# EAGLE design 1601_board_firmata (EAGLE 9.6.2)
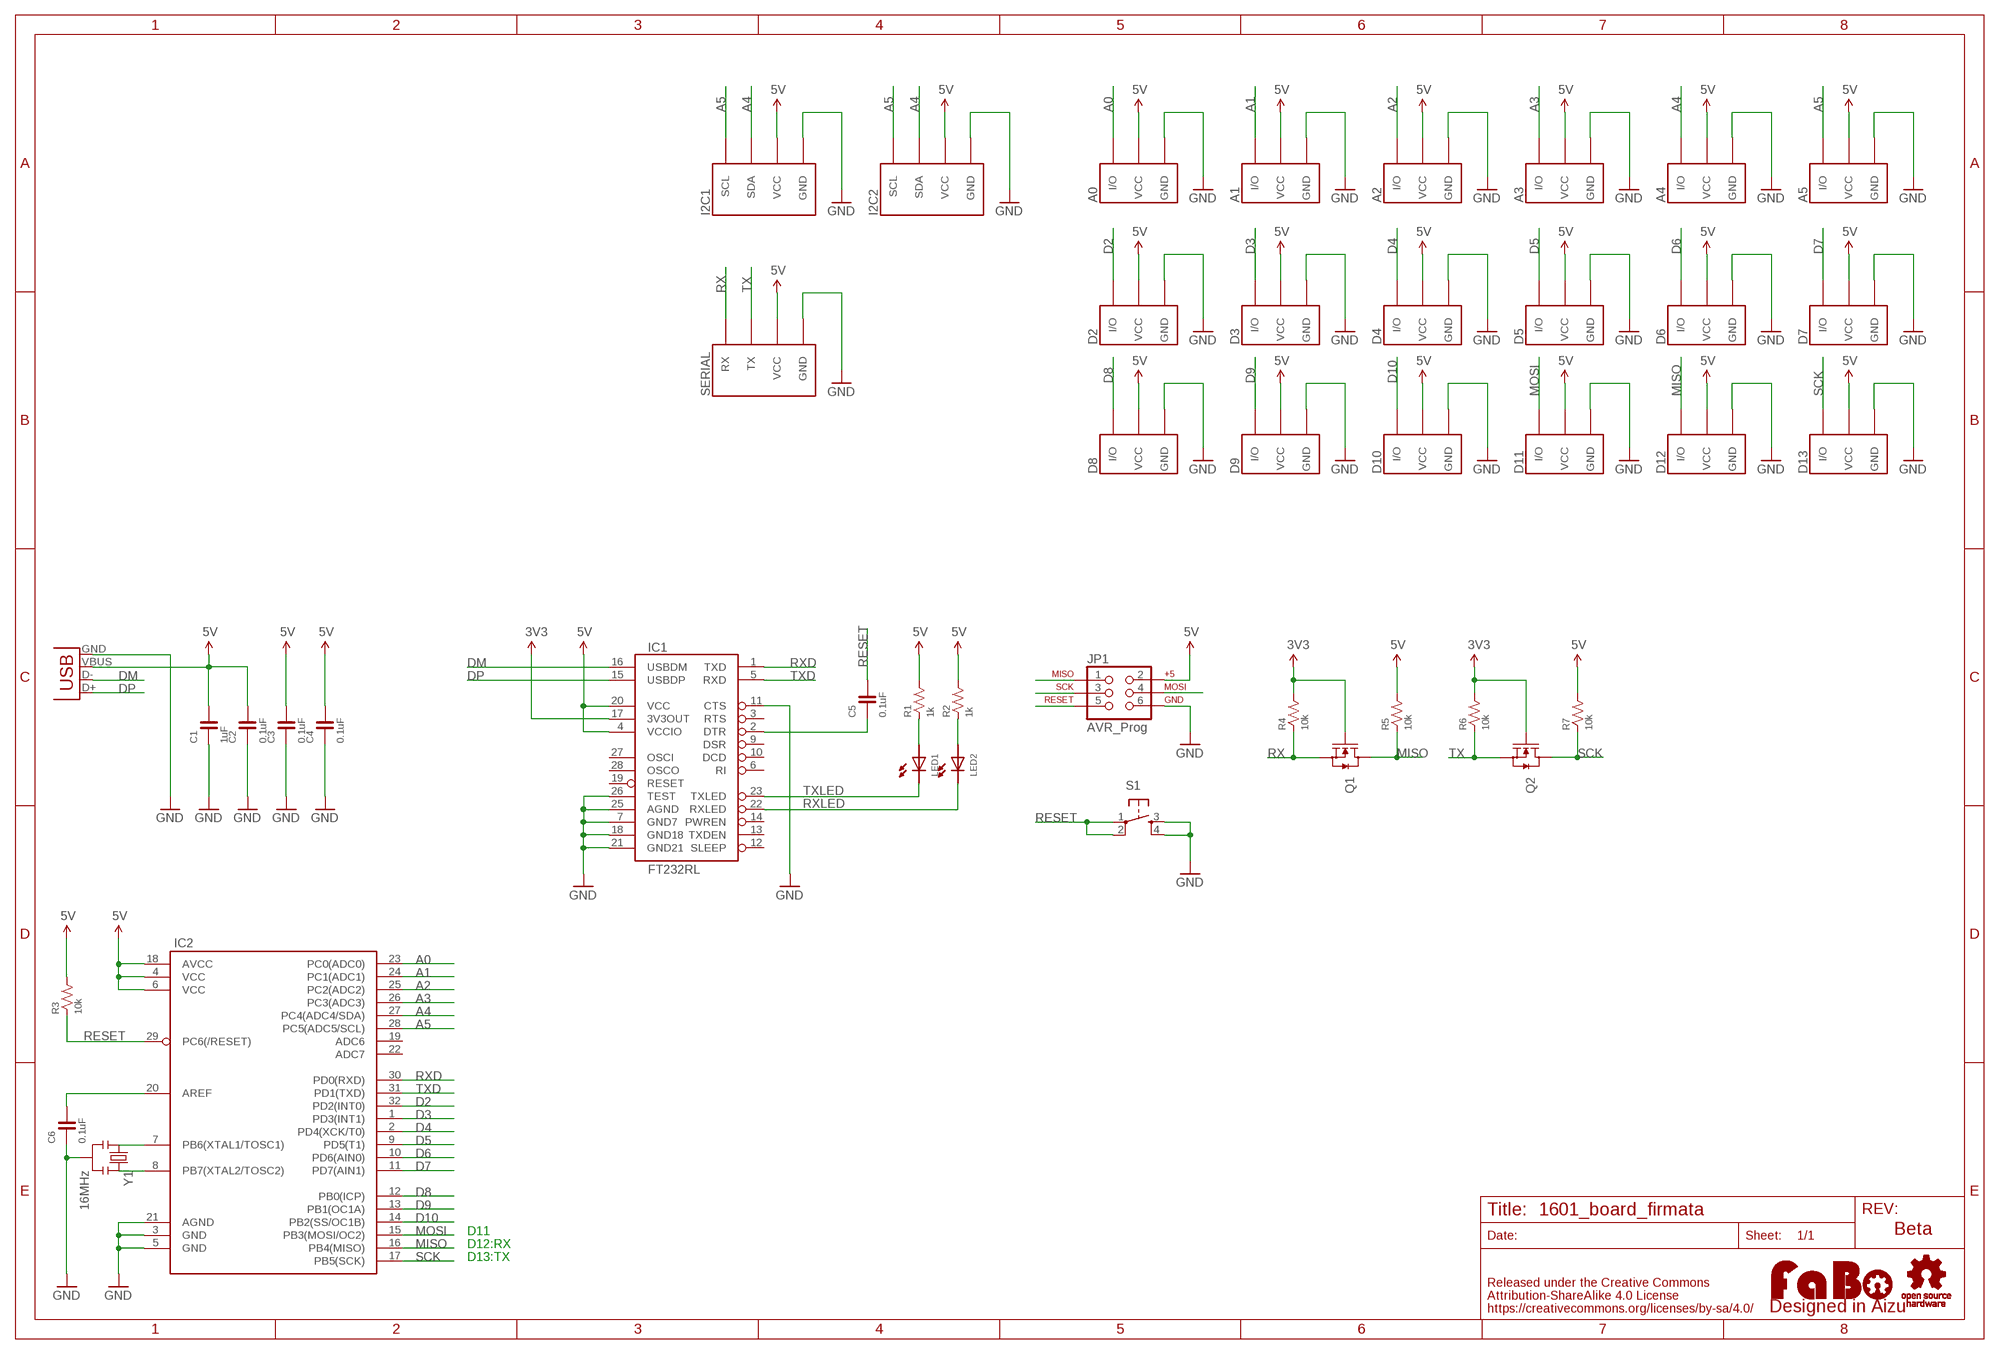
[diagram p0: schematic, sheet 1]

## Parts
A0  FABO_BRICK_3PIN-S03B-PASK-2  [FABO_BRICK_3PIN_S03B-PASK-2]
A1  FABO_BRICK_3PIN-S03B-PASK-2  [FABO_BRICK_3PIN_S03B-PASK-2]
A2  FABO_BRICK_3PIN-S03B-PASK-2  [FABO_BRICK_3PIN_S03B-PASK-2]
A3  FABO_BRICK_3PIN-S03B-PASK-2  [FABO_BRICK_3PIN_S03B-PASK-2]
A4  FABO_BRICK_3PIN-S03B-PASK-2  [FABO_BRICK_3PIN_S03B-PASK-2]
A5  FABO_BRICK_3PIN-S03B-PASK-2  [FABO_BRICK_3PIN_S03B-PASK-2]
C1  1uF  CAPACITOR-0603  [0603]
C2  0.1uF  CAPACITOR-0603  [0603]
C3  0.1uF  CAPACITOR-0603  [0603]
C4  0.1uF  CAPACITOR-0603  [0603]
C5  0.1uF  CAPACITOR-0603  [0603]
C6  0.1uF  CAPACITOR-0603  [0603]
D2  FABO_BRICK_3PIN-B03B-PASK-1  [FABO_BRICK_3PIN_B03B-PASK-1]
D3  FABO_BRICK_3PIN-B03B-PASK-1  [FABO_BRICK_3PIN_B03B-PASK-1]
D4  FABO_BRICK_3PIN-B03B-PASK-1  [FABO_BRICK_3PIN_B03B-PASK-1]
D5  FABO_BRICK_3PIN-B03B-PASK-1  [FABO_BRICK_3PIN_B03B-PASK-1]
D6  FABO_BRICK_3PIN-B03B-PASK-1  [FABO_BRICK_3PIN_B03B-PASK-1]
D7  FABO_BRICK_3PIN-B03B-PASK-1  [FABO_BRICK_3PIN_B03B-PASK-1]
D8  FABO_BRICK_3PIN-B03B-PASK-1  [FABO_BRICK_3PIN_B03B-PASK-1]
D9  FABO_BRICK_3PIN-B03B-PASK-1  [FABO_BRICK_3PIN_B03B-PASK-1]
D10  FABO_BRICK_3PIN-B03B-PASK-1  [FABO_BRICK_3PIN_B03B-PASK-1]
D11  FABO_BRICK_3PIN-B03B-PASK-1  [FABO_BRICK_3PIN_B03B-PASK-1]
D12  FABO_BRICK_3PIN-B03B-PASK-1  [FABO_BRICK_3PIN_B03B-PASK-1]
D13  FABO_BRICK_3PIN-B03B-PASK-1  [FABO_BRICK_3PIN_B03B-PASK-1]
I2C1  FABO_BRICK_I2C-S04B-PASK-2  [FABO_BRICK_I2C_S04B-PASK-2]
I2C2  FABO_BRICK_I2C-S04B-PASK-2  [FABO_BRICK_I2C_S04B-PASK-2]
IC1  FT232RL  [SSOP28]
IC2  ATMEGA328P-AU-TQFP32  [TQFP-32-08]
JP1  AVR_Prog  AVR_ISP-TC  [TC2030-MCP]
LED1  LED-0603  [0603]
LED2  LED-0603  [0603]
Q1  MOSFET-N-BSS138  [SOT23-3]
Q2  MOSFET-N-BSS138  [SOT23-3]
R1  1k  RESISTOR-0603  [0603]
R2  1k  RESISTOR-0603  [0603]
R3  10k  RESISTOR-0603  [0603]
R4  10k  RESISTOR-0603  [0603]
R5  10k  RESISTOR-0603  [0603]
R6  10k  RESISTOR-0603  [0603]
R7  10k  RESISTOR-0603  [0603]
S1  TACT-SWITCH-SMD_KMR2  [KMR2]
SERIAL  FABO_BRICK_SERIAL-S04B-PASK-2  [FABO_BRICK_SERIAL_S04B-PASK-2]
U$2  LOGO_OSHW-T_M_BOTTOM  [LOGO_OSHW_T_MS_BOTTOM]
U$3  LOGO_FABO-M  [LOGO_FABO_MS]
USB1  USB-B-MICRO_SMD  [USB_B_MICRO]
Y1  16MHz  RESONATOR  [RESONATOR_SMD]

## Nets
3V3: IC1.17(3V3OUT) Q1.1(G) Q2.1(G) R4.2 R6.2
5V: A0.VCC A1.VCC A2.VCC A3.VCC A4.VCC A5.VCC C1.2 C2.2 C3.2 C4.2 D2.VCC D3.VCC D4.VCC D5.VCC D6.VCC D7.VCC D8.VCC D9.VCC D10.VCC D11.VCC D12.VCC D13.VCC I2C1.VCC I2C2.VCC IC1.4(VCCIO) IC1.20(VCC) IC2.4(VCC) IC2.6(VCC) IC2.18(AVCC) JP1.2 R1.2 R2.2 R3.2 R5.2 R7.2 SERIAL.VCC USB1.VBUS
A0: A0.I/O IC2.23(PC0(ADC0))
A1: A1.I/O IC2.24(PC1(ADC1))
A2: A2.I/O IC2.25(PC2(ADC2))
A3: A3.I/O IC2.26(PC3(ADC3))
A4: A4.I/O I2C1.SDA I2C2.SDA IC2.27(PC4(ADC4/SDA))
A5: A5.I/O I2C1.SCL I2C2.SCL IC2.28(PC5(ADC5/SCL))
D2: D2.I/O IC2.32(PD2(INT0))
D3: D3.I/O IC2.1(PD3(INT1))
D4: D4.I/O IC2.2(PD4(XCK/T0))
D5: D5.I/O IC2.9(PD5(T1))
D6: D6.I/O IC2.10(PD6(AIN0))
D7: D7.I/O IC2.11(PD7(AIN1))
D8: D8.I/O IC2.12(PB0(ICP))
D9: D9.I/O IC2.13(PB1(OC1A))
D10: D10.I/O IC2.14(PB2(SS/OC1B))
DM: IC1.16(USBDM) USB1.D-
DP: IC1.15(USBDP) USB1.D+
DTR: C5.1 IC1.2(DTR)
GND: A0.GND A1.GND A2.GND A3.GND A4.GND A5.GND C1.1 C2.1 C3.1 C4.1 C6.1 D2.GND D3.GND D4.GND D5.GND D6.GND D7.GND D8.GND D9.GND D10.GND D11.GND D12.GND D13.GND I2C1.GND I2C2.GND IC1.7(GND7) IC1.11(CTS) IC1.18(GND18) IC1.21(GND21) IC1.25(AGND) IC1.26(TEST) IC2.3(GND) IC2.5(GND) IC2.21(AGND) JP1.6 S1.3 S1.4 SERIAL.GND USB1.GND Y1.2
MISO: D12.I/O IC2.16(PB4(MISO)) JP1.1 Q1.3(D) R5.1
MOSI: D11.I/O IC2.15(PB3(MOSI/OC2)) JP1.4
N$1: LED1.ANODE R1.1
N$2: C6.2 IC2.20(AREF)
N$3: IC2.8(PB7(XTAL2/TOSC2)) Y1.3
N$4: IC2.7(PB6(XTAL1/TOSC1)) Y1.1
N$30: LED2.ANODE R2.1
RESET: C5.2 IC2.29(PC6(/RESET)) JP1.5 R3.1 S1.1 S1.2
RX: Q1.2(S) R4.1 SERIAL.RX
RXD: IC1.1(TXD) IC2.30(PD0(RXD))
RXLED: IC1.22(RXLED) LED2.CATHODE
SCK: D13.I/O IC2.17(PB5(SCK)) JP1.3 Q2.3(D) R7.1
TX: Q2.2(S) R6.1 SERIAL.TX
TXD: IC1.5(RXD) IC2.31(PD1(TXD))
TXLED: IC1.23(TXLED) LED1.CATHODE
Unconnected: IC1.3(RTS) IC1.6(RI) IC1.9(DSR) IC1.10(DCD) IC1.12(SLEEP) IC1.13(TXDEN) IC1.14(PWREN) IC1.19(RESET) IC1.27(OSCI) IC1.28(OSCO) IC2.19(ADC6) IC2.22(ADC7)

## Notes on the sheet
- D11 | Beta
- D12:RX
- D13:TX

## Library data of the parts
A0 A1-A5 D2-D13 = FaBo-Template:FABO_BRICK_3PIN: FaBo Brick 3pin
C1-C6 = FaBo-Capacitor:CAPACITOR: CAPACITOR
I2C1 I2C2 = FaBo-Template:FABO_BRICK_I2C: FaBo Brick I2C
IC1 = Gclue:FT232RL: FT232RL FTDI FT232RL USB to serial UART interface SSOP28
IC2 = FaBo-etc:ATMEGA328P-AU: ATmega328p-AU
JP1 = Gclue:AVR_ISP
LED1 LED2 = FaBo-LED:LED
Q1 Q2 = FaBo-etc:MOSFET-N
R1-R7 = FaBo-Resistors:RESISTOR: RESISTOR
S1 = FaBo-Switch:TACT-SWITCH
SERIAL = FaBo-Template:FABO_BRICK_SERIAL: FaBo Brick Serial
U$2 = FaBo-etc:LOGO_OSHW
U$3 = FaBo-Logo:LOGO_FABO
USB1 = Gclue:USB: USB Female
Y1 = Gclue:RESONATOR: RESONATOR CSTCE16M0V53

## Board
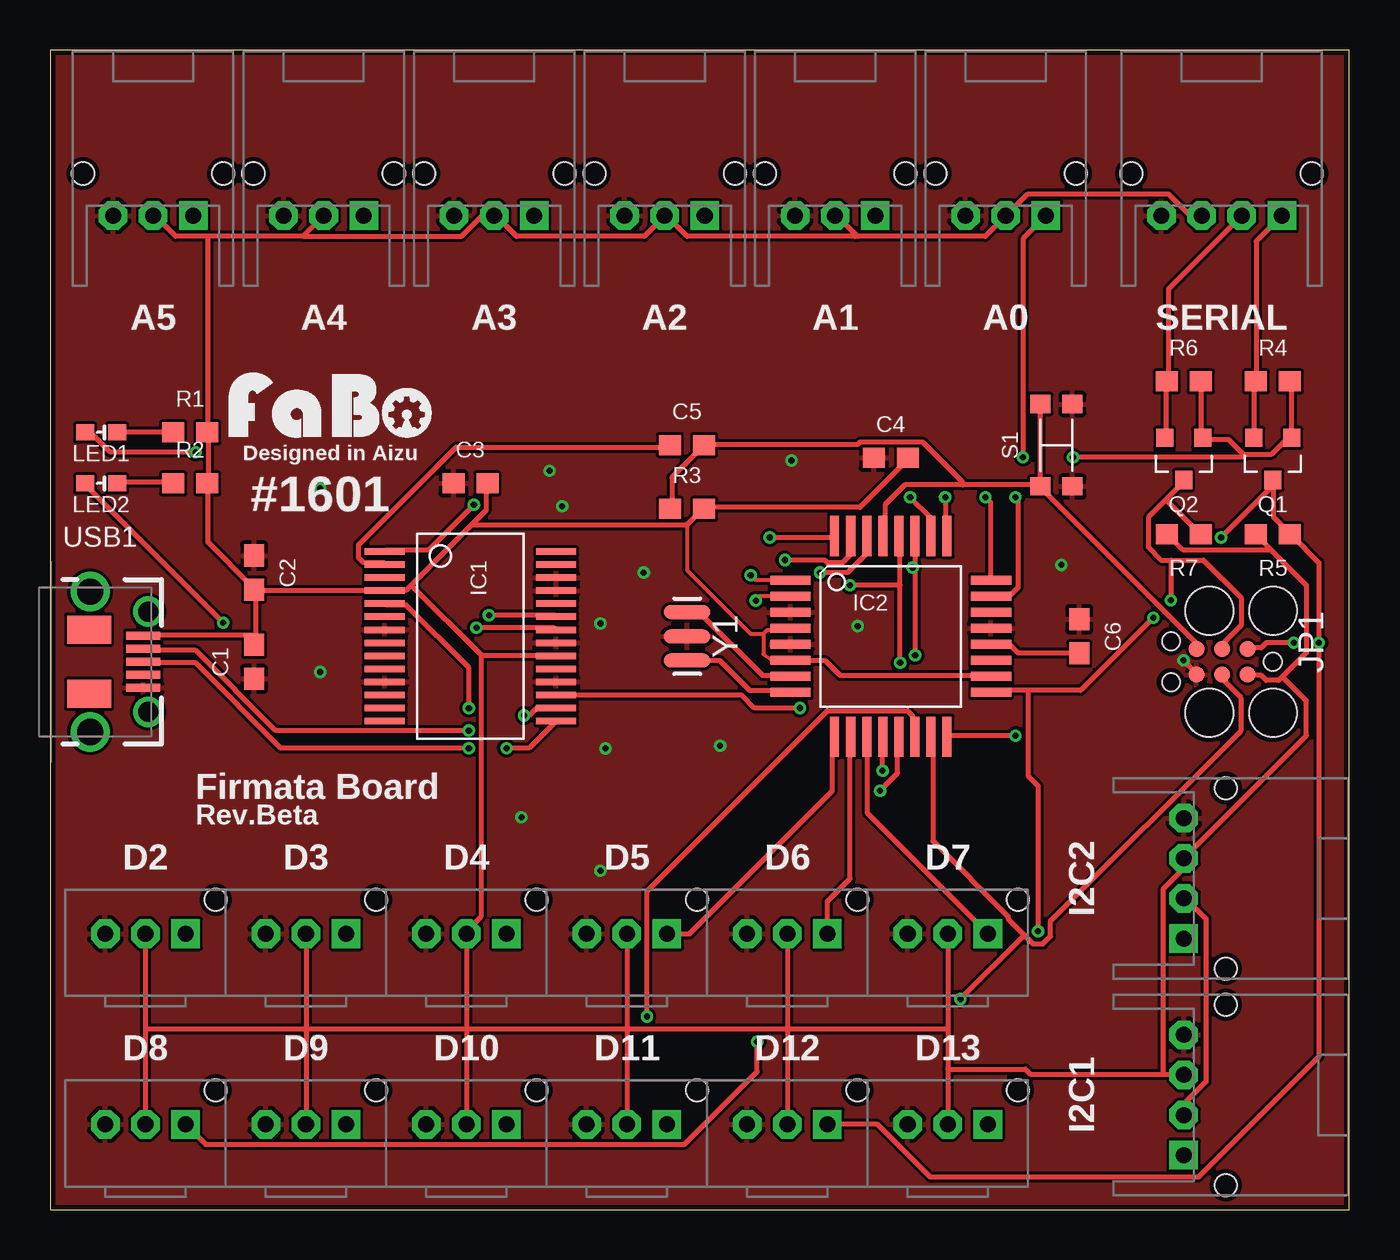
[diagram p1: board, top side]
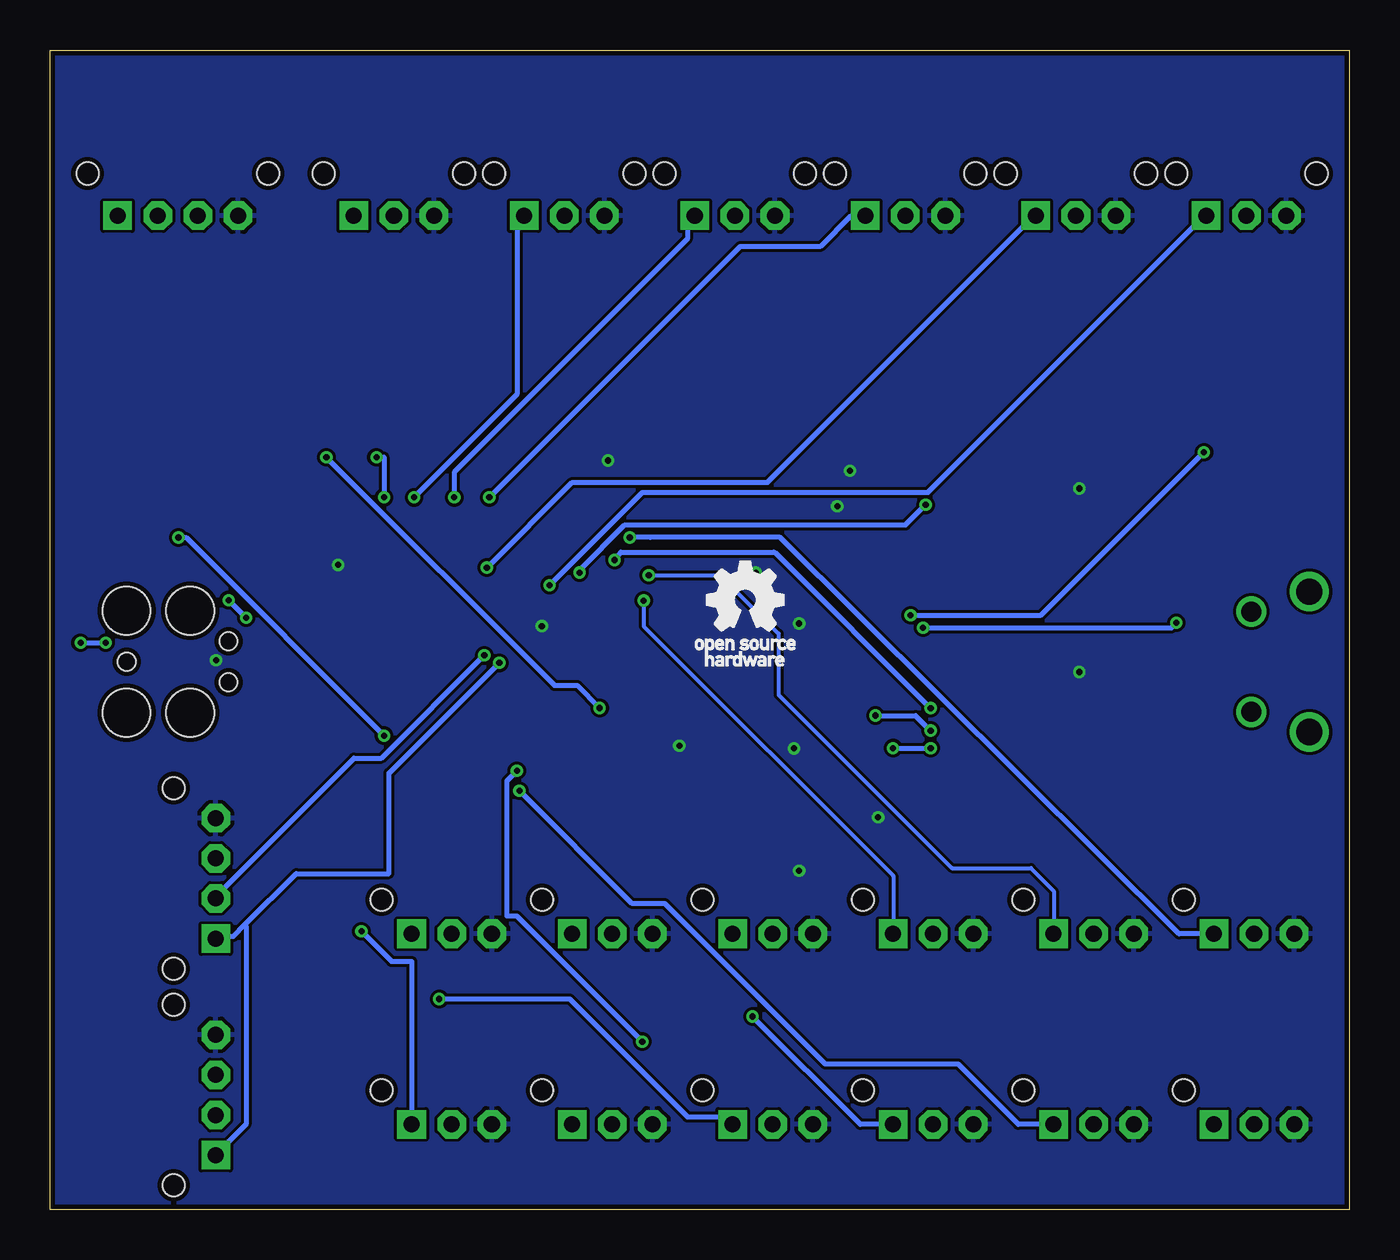
[diagram p2: board, bottom side, seen from below]

Size 64.77 x 57.78 mm. Coordinates in mm from the lower left corner, seen from the top.
Outline: 0,0 64.77,0 64.77,57.78 0,57.78 0,0
Copper layers (1*16): Top 0.035mm / dielectric 1.6mm / Bottom 0.035mm
Design rules "PCBway": minimum track width 6mil, minimum drill 12mil, track to track 6mil, track to pad 6mil, pad to pad 6mil, via to via 6mil, smd to smd 6mil, copper to edge 10mil, drill to drill 10mil, minimum pad ring 10mil, minimum via ring 6mil, stop-mask expansion 2mil, vias tented up to drill 100mil, thermal gap 8mil

### Footprints (pad centres in the part's own frame; a part is rotated, then mirrored left to right if it is on the bottom)
FABO_BRICK_3PIN_S03B-PASK-2 = drill 0.8 pad 1.422 octagon: GND -2,0; VCC 0,0 | drill 0.8 pad 1.422 square: I/O 2,0 | hole 1.1: 3.5,2.1; -3.5,2.1
0603 = smd 1.1 x 1: 1 -0.85,0; 2 0.85,0
FABO_BRICK_3PIN_B03B-PASK-1 = drill 0.8 pad 1.422 octagon: GND -2,0; VCC 0,0 | drill 0.8 pad 1.422 square: I/O 2,0 | hole 1.1: 3.5,1.7
FABO_BRICK_I2C_S04B-PASK-2 = drill 0.8 pad 1.422 octagon: GND -3,0; SDA 1,0; VCC -1,0 | drill 0.8 pad 1.422 square: SCL 3,0 | hole 1.1: 4.5,2.1; -4.5,2.1
SSOP28 = smd 0.325 x 2: 1 -4.225,-4.275; 2 -3.575,-4.275; 3 -2.925,-4.275; 4 -2.275,-4.275; 5 -1.625,-4.275; 6 -0.975,-4.275; 7 -0.325,-4.275; 8 0.325,-4.275; 9 0.975,-4.275; 10 1.625,-4.275; 11 2.275,-4.275; 12 2.925,-4.275; 13 3.575,-4.275; 14 4.225,-4.275; 15 4.225,4.275; 16 3.575,4.275; 17 2.925,4.275; 18 2.275,4.275; 19 1.625,4.275; 20 0.975,4.275; 21 0.325,4.275; 22 -0.325,4.275; 23 -0.975,4.275; 24 -1.625,4.275; 25 -2.275,4.275; 26 -2.925,4.275; 27 -3.575,4.275; 28 -4.225,4.275
TQFP-32-08 = smd 2 x 0.45: 1 -5,2.8; 2 -5,2; 3 -5,1.2; 4 -5,0.4; 5 -5,-0.4; 6 -5,-1.2; 7 -5,-2; 8 -5,-2.8; 17 5,-2.8; 18 5,-2; 19 5,-1.2; 20 5,-0.4; 21 5,0.4; 22 5,1.2; 23 5,2; 24 5,2.8 | smd 0.45 x 2: 9 -2.8,-5; 10 -2,-5; 11 -1.2,-5; 12 -0.4,-5; 13 0.4,-5; 14 1.2,-5; 15 2,-5; 16 2.8,-5; 25 2.8,5; 26 2,5; 27 1.2,5; 28 0.4,5; 29 -0.4,5; 30 -1.2,5; 31 -2,5; 32 -2.8,5
TC2030-MCP = smd 0.787 x 0.787: 1 -1.27,-0.635; 2 -1.27,0.635; 3 0,-0.635; 4 0,0.635; 5 1.27,-0.635; 6 1.27,0.635 | hole 0.889: -2.54,0; 2.54,-1.016; 2.54,1.016 | hole 2.375: -2.54,2.54; -2.54,-2.54; 0.635,-2.54; 0.635,2.54
0603' = smd 0.9 x 0.8: ANODE -0.8,0; CATHODE 0.8,0
SOT23-3 = smd 0.85 x 0.9: 1 -0.95,-1; 2 0.95,-1; 3 0,1.1
KMR2 = smd 0.9 x 1: 1 -2.05,0.8; 2 2.05,0.8; 3 2.05,-0.8; 4 -2.05,-0.8
FABO_BRICK_SERIAL_S04B-PASK-2 = drill 0.8 pad 1.422 octagon: GND -3,0; TX 1,0; VCC -1,0 | drill 0.8 pad 1.422 square: RX 3,0 | hole 1.1: 4.5,2.1; -4.5,2.1
USB_B_MICRO = smd 1.7 x 0.4: D+ 2.1,0; D- 2.1,0.65; GND 2.1,-1.3; ID 2.1,-0.65; VBUS 2.1,1.3 | drill 1 pad 1.4: P$1 2.35,2.5; P$2 2.35,-2.5 | drill 1.3 pad 1.7: P$3 -0.55,3.5; P$4 -0.55,-3.5 | smd 2.2 x 1.4: P$6 -0.6,1.6; P$7 -0.6,-1.6
RESONATOR_SMD = smd 0.7 x 2.3: 1 -1.2,0; 2 0,0; 3 1.2,0

### Placement (x,y rotation side)
A0  47.63,49.54 0 top
A1  39.13,49.54 0 top
A2  30.64,49.54 0 top
A3  22.14,49.54 0 top
A4  13.63,49.54 0 top
A5  5.13,49.54 0 top
C1  10.16,27.3 90 top
C2  10.16,31.75 270 top
C3  20.95,36.2 0 top
C4  41.91,37.47 0 top
C5  31.75,38.1 0 top
C6  51.31,28.57 270 top
D2  4.75,13.75 0 top
D3  12.75,13.75 0 top
D4  20.75,13.75 0 top
D5  28.75,13.75 0 top
D6  36.75,13.75 0 top
D7  44.75,13.75 0 top
D8  4.75,4.25 0 top
D9  12.75,4.25 0 top
D10  20.75,4.25 0 top
D11  28.75,4.25 0 top
D12  36.75,4.25 0 top
D13  44.75,4.25 0 top
I2C1  56.52,5.71 270 top
I2C2  56.52,16.51 270 top
IC1  20.95,28.57 270 top
IC2  41.91,28.57 0 top
JP1  58.42,27.3 180 top
LED1  [0603']  2.54,38.73 180 top
LED2  [0603']  2.54,36.2 180 top
Q1  60.96,37.47 180 top
Q2  56.52,37.47 180 top
R1  6.99,38.73 0 top
R2  6.99,36.2 0 top
R3  31.75,34.92 0 top
R4  60.96,41.27 0 top
R5  60.96,33.66 180 top
R6  56.52,41.27 0 top
R7  56.52,33.66 180 top
S1  50.16,38.1 90 top
SERIAL  58.41,49.54 0 top
U$2  30.1,30.35 0 top
U$3  13.97,38.1 0 top
USB1  2.54,27.3 0 top
Y1  31.75,28.57 270 top

### Tracks (layer width: path | path; a pad name or v marks a point on that pad's centre or on a via)
3V3  (via drill 0.3)
  Top 0.254: R6.2 57.38,41.25 57.38,38.5 Q2.1 57.5,38.38 58.75,38.38 59.5,37.62 | R4.2 61.88,41.25 61.88,38.5 Q1.1 61.75,38.5 60.88,37.62 59.5,37.62 | v37.38,25 35.12,25 34.5,25.62 25.25,25.62 IC1.17 | v51,37.5 59.5,37.5 59.5,37.62
  Bottom 0.254: v37.38,25 38.5,26.12 39.62,26.12 v51,37.5
5V
  Top 0.203: 36,27.38 35.56,27.69 35.56,28.7 | 35.56,28.7 35.75,28.88 36.88,28.88 | 31.75,34.12 31.75,31.88 34.92,28.7 35.56,28.7
  Top 0.254: 40.19,48.56 40.25,48.5 46.62,48.5 47.62,49.5 A0.VCC 47.75,49.62 48.75,50.62 55.75,50.62 56.75,49.62 57.38,49.62 SERIAL.VCC | 40.19,48.56 39.25,49.5 A1.VCC | 40.19,48.56 40.12,48.5 31.75,48.5 30.75,49.5 A2.VCC 30.62,49.5 29.62,48.5 23.25,48.5 22.25,49.5 A3.VCC 22.12,49.5 21.5,49.5 20.5,48.5 12.62,48.5 | C4.2 42.75,37.38 40.38,35 32.62,35 R3.2 32.5,34.88 31.75,34.12 21.12,34.12 21.06,34.19 | 36,27.38 IC2.6 38.62,27.38 39.38,26.62 46.88,26.62 IC2.18 | 36.88,28.88 IC2.4 | 18,31.12 17.75,30.88 16.75,30.88 IC1.4 16.62,30.88 10.38,30.88 C2.2 | 18,31.12 21.06,34.19 | 21.06,34.19 21.75,34.88 21.75,36.12 C3.2 | 21.5,27.62 25.12,27.62 IC1.20 | 18,31.12 21.5,27.62 | 12.62,48.5 7.88,48.5 | 7.88,48.5 6.25,48.5 5.25,49.5 A5.VCC | 12.62,48.5 13.62,49.5 A4.VCC | C2.2 10.25,30.88 10.25,28.25 C1.2 10.12,28.62 4.75,28.62 USB1.VBUS | C2.2 10.12,31 7.88,33.25 7.88,36.12 R2.2 7.88,36.25 7.88,38.62 R1.2 7.88,38.75 7.88,48.5 | D2.VCC 4.75,9 | 4.75,9 D8.VCC | D3.VCC 12.75,9 | 12.75,9 D9.VCC | 12.75,9 4.75,9 | 20.75,9 D4.VCC 20.75,13.88 21.5,14.62 21.5,27.62 | 20.75,9 D10.VCC | D5.VCC 28.75,9 | 28.75,9 D11.VCC | 28.75,9 20.75,9 | 20.75,9 12.75,9 | D6.VCC 36.75,9 | 36.75,9 D12.VCC | 61.44,26.56 62.62,27.75 62.62,31.12 60.81,32.94 | 61.44,26.56 61.25,26.38 60.62,26.38 60.38,26.62 59.75,26.62 JP1.2 | 60.81,32.94 60.12,33.62 R5.2 | R7.2 55.75,33.62 56.5,32.88 60.75,32.88 60.81,32.94 | D7.VCC 44.75,9 | 44.75,9 44.75,7 | 44.75,7 D13.VCC | 55.5,6.75 48.88,6.75 48.62,7 44.75,7 | 55.5,6.75 56.5,6.75 I2C1.VCC | 55.5,6.75 55.5,16 56.5,17 56.5,17.5 I2C2.VCC 56.62,17.62 62.62,23.62 62.62,25.38 61.44,26.56 | 44.75,9 36.75,9 | 36.75,9 28.75,9
A0  (via drill 0.3)
  Top 0.254: v48.12,35.5 48.25,35.38 48.25,31 47.88,30.62 47,30.62 IC2.23 | v48.5,37.5 48.5,48.38 49.62,49.5 A0.I/O
  Bottom 0.254: v48.12,35.5 48.12,37.5 v48.5,37.5
A1  (via drill 0.3)
  Top 0.254: v46.62,35.5 46.88,35.25 46.88,31.38 IC2.24
  Bottom 0.254: v46.62,35.5 41.5,40.62 41.5,49.5 41.25,49.5 A1.I/O
A2  (via drill 0.3)
  Top 0.254: v44.62,35.5 44.62,33.62 IC2.25
  Bottom 0.254: v44.62,35.5 44.62,36.75 33,48.38 33,49.5 32.75,49.5 A2.I/O
A3  (via drill 0.3)
  Top 0.254: v42.88,35.5 43.88,34.5 43.88,33.62 IC2.26
  Bottom 0.254: v42.88,35.5 30.38,48 26.38,48 24.88,49.5 24.25,49.5 A3.I/O
A4  (via drill 0.3)
  Top 0.254: v43.12,27.62 43.12,32 | 43.12,32 43.12,33.5 IC2.27 | I2C1.SDA 56.62,4.75 56.62,5.38 57.62,6.38 57.62,14.5 56.62,15.5 I2C2.SDA | v43,32 43.12,32
  Bottom 0.254: v43.12,27.62 48.25,22.5 49.62,22.5 56.5,15.62 I2C2.SDA | v43,32 38.75,36.25 29,36.25 15.75,49.5 A4.I/O
A5  (via drill 0.3)
  Top 0.254: v42.38,27.25 42.38,31.12 | 42.38,31.12 42.38,33.5 IC2.28 | 42.38,31.12 v39.88,31.12
  Bottom 0.254: v42.38,27.25 47.88,21.75 47.88,16.75 52.5,16.75 55.06,14.19 | 55.06,14.19 55.62,13.62 56.5,13.62 I2C2.SCL | v39.88,31.12 35.25,35.75 21,35.75 7.25,49.5 A5.I/O | I2C1.SCL 56.5,2.75 55,4.25 55,14.12 55.06,14.19
D2  (via drill 0.3)
  Top 0.254: v35.88,33.5 39,33.5 IC2.32
  Bottom 0.254: v35.88,33.5 34.86,33.5 28.38,33.5 8.5,13.75 D2.I/O
D3  (via drill 0.3)
  Top 0.203: IC2.1 35.17,31.38 v34.92,31.62
  Bottom 0.203: v34.92,31.62 31.37,31.62 28.45,28.7 28.45,25.65 19.81,17.02 15.88,17.02 14.73,15.88 14.73,13.77 D3.I/O
D4  (via drill 0.3)
  Top 0.203: IC2.2 35.4,30.57 v35.18,30.35
  Bottom 0.203: v35.18,30.35 35.18,29.08 22.73,16.64 22.73,13.77 D4.I/O
D5
  Top 0.254: D5.I/O 31.88,13.75 39,20.88 39,23.5 IC2.9
D6
  Top 0.254: D6.I/O 38.75,15.38 39.88,16.5 39.88,23.5 IC2.10
D7
  Top 0.254: D7.I/O 40.75,19.75 40.75,23.5 IC2.11
D8  (via drill 0.3)
  Top 0.254: v41.5,21.88 41.5,23.5 IC2.12 | v35.25,8.38 35.25,6.88 31.62,3.25 7.75,3.25 D8.I/O
  Bottom 0.254: v41.5,21.88 42,21.38 42,14.62 41.5,14.62 v35.25,8.38
D9  (via drill 0.3)
  Top 0.254: v41.38,20.88 42.25,21.75 42.25,23.5 IC2.13
  Bottom 0.254: v41.38,20.88 35.75,15.25 34.12,15.25 26.12,7.25 19.5,7.25 16.5,4.25 D9.I/O
D10  (via drill 0.3)
  Top 0.254: v29.75,9.62 29.75,15.88 38.75,24.88 42.75,24.88 43,24.62 43,23.62 IC2.14
  Bottom 0.254: v29.75,9.62 24.38,4.25 D10.I/O
DM  (via drill 0.3)
  Top 0.254: v20.88,23.88 11.25,23.88 7.25,27.88 4.75,27.88 USB1.D- | v23.62,24.62 23.88,24.62 24.25,25 IC1.16
  Bottom 0.254: v20.88,23.88 21.62,24.62 v23.62,24.62
DP  (via drill 0.3)
  Top 0.254: v20.88,23 11.5,23 7.25,27.25 4.75,27.25 USB1.D+ | v22.75,23 23.88,23 25.12,24.25 IC1.15
  Bottom 0.254: v22.75,23 v20.88,23
DTR
  Top 0.254: C5.1 30.88,38 20.25,38 15.38,33.12 15.38,32.5 15.62,32.25 16.62,32.25 IC1.2
GND  (via drill 0.3)
  Top 0.254: v56.5,27.38 57.12,26.75 JP1.6
  other vias: 13.46,26.8 13.46,35.94 25.53,35.05 24.89,36.83 27.43,29.21 36.96,37.34 29.59,31.75 40.26,29.08 50.42,32.13 33.4,23.11 27.43,16.89 23.5,19.56 27.69,22.99
  pour Bottom: -0.64,-0.64 65.41,-0.64 65.41,58.42 -0.64,58.42
  pour Top: -0.64,-0.64 65.41,-0.64 65.41,58.42 -0.64,58.42
MISO  (via drill 0.3)
  Top 0.254: v62,28.25 60.62,28.25 60.38,28 59.75,28 JP1.1 | v48.12,23.62 44.75,23.62 IC2.16 | v58.38,33.5 60.88,36 Q1.3 61,36.25 61,34.5 61.75,33.75 R5.1 61.88,33.62 63.25,32.25 v63.25,28.25 63.25,7.62 57.25,1.62 43.88,1.62 41.25,4.25 D12.I/O
  Bottom 0.254: v63.25,28.25 v62,28.25 | v48.12,23.62 58,33.5 v58.38,33.5
MOSI  (via drill 0.3)
  Top 0.254: 48.56,13.69 47.75,14.5 47.75,14.62 44,18.38 44,23.5 IC2.15 | 48.56,13.69 49,13.25 49.5,13.25 49.88,13.62 49.88,14.38 59.38,23.88 59.38,25.5 58.5,26.38 58.5,26.62 JP1.4 | 48.56,13.69 v45.38,10.5
  Bottom 0.254: D11.I/O 31.12,4.62 33,4.62 38.88,10.5 v45.38,10.5
N$1
  Top 0.254: LED1.ANODE 3.38,38.75 6.12,38.75 R1.1
N$2
  Top 0.254: C6.2 51.38,27.75 48.25,27.75 47.88,28.12 47,28.12 IC2.20
N$3
  Top 0.254: Y1.3 33.38,27.38 34.88,25.88 36.88,25.88 IC2.8
N$4
  Top 0.254: IC2.7 36.88,26.62 35.5,26.62 32.38,29.75 31.75,29.75 Y1.1
N$30
  Top 0.254: LED2.ANODE 3.38,36.25 6.12,36.25 R2.1
RESET
  Top 0.254: R3.1 31,35 31,36.5 C5.2 32.62,38.12 40.25,38.12 40.38,38.25 43.5,38.25 45.5,36.25 45.5,36.12 | JP1.5 57.12,28 57.12,28.25 49.38,36 S1.1 | S1.2 49.38,40.12 49.38,36.12 S1.1 | 45.5,36.12 49.25,36.12 S1.1 | 45.5,36.12 42.62,36.12 41.62,35.12 41.62,33.62 IC2.29
RX
  Top 0.254: Q1.2 60,38.5 60,41.25 R4.1 60.12,41.38 60.12,48.25 61.38,49.5 SERIAL.RX
RXD  (via drill 0.3)
  Top 0.254: v21.12,35.12 18.88,32.88 16.75,32.88 IC1.1 | v38.38,31.75 39.75,31.75 40.62,32.62 40.62,33.5 IC2.30
  Bottom 0.254: v21.12,35.12 22.12,34.12 36.12,34.12 38.38,31.88 v38.38,31.75
RXLED  (via drill 0.3)
  Top 0.254: v8.62,29.25 1.75,36.12 LED2.CATHODE | v21.25,29 25.12,29 IC1.22
  Bottom 0.254: v8.62,29.25 8.88,29 v21.25,29
SCK  (via drill 0.3)
  Top 0.254: 55.88,32.38 55.38,32.38 54.75,33 54.75,34.5 55.62,35.38 | 55.88,32.38 57.5,32.38 59.38,30.5 59.38,29.12 58.5,28.25 58.5,28 JP1.3 | 55.62,35.38 56.5,36.25 Q2.3 | 55.62,35.38 57.25,33.75 R7.1 | 48.75,25.88 51.38,25.88 v55,29.5 | 48.75,25.88 47,25.88 IC2.17 | 55.88,32.38 v55.88,30.38 | v49.25,13.88 49.25,21.12 48.75,21.62 48.75,25.88
  Bottom 0.254: v55.88,30.38 v55,29.5 | D13.I/O 46.75,12.38 47.75,12.38 v49.25,13.88
TX
  Top 0.254: Q2.2 55.62,38.5 55.62,41.25 R6.1 55.75,41.38 55.75,45.88 59.38,49.5 SERIAL.TX
TXD  (via drill 0.3)
  Top 0.254: v20.88,25 20.88,27 17.75,30.12 16.75,30.12 IC1.5 | v36.63,32.38 38.62,32.38 38.75,32.25 39.5,32.25 39.88,32.62 39.88,33.5 IC2.31
  Bottom 0.254: v20.88,25 28.64,32.76 28.7,32.76 28.7,32.77 36.32,32.77 v36.63,32.38
TXLED  (via drill 0.3)
  Top 0.254: v7.25,37.75 3,37.75 2.12,38.62 1.75,38.62 LED1.CATHODE | v21.88,29.62 25.12,29.62 IC1.23
  Bottom 0.254: v7.25,37.75 15.38,29.62 v21.88,29.62

### Text on the board
tPlace: Designed in Aizu | #1601 | Firmata Board | Rev.Beta